# EAGLE design midicontrol_v4 (EAGLE 9.4.0)
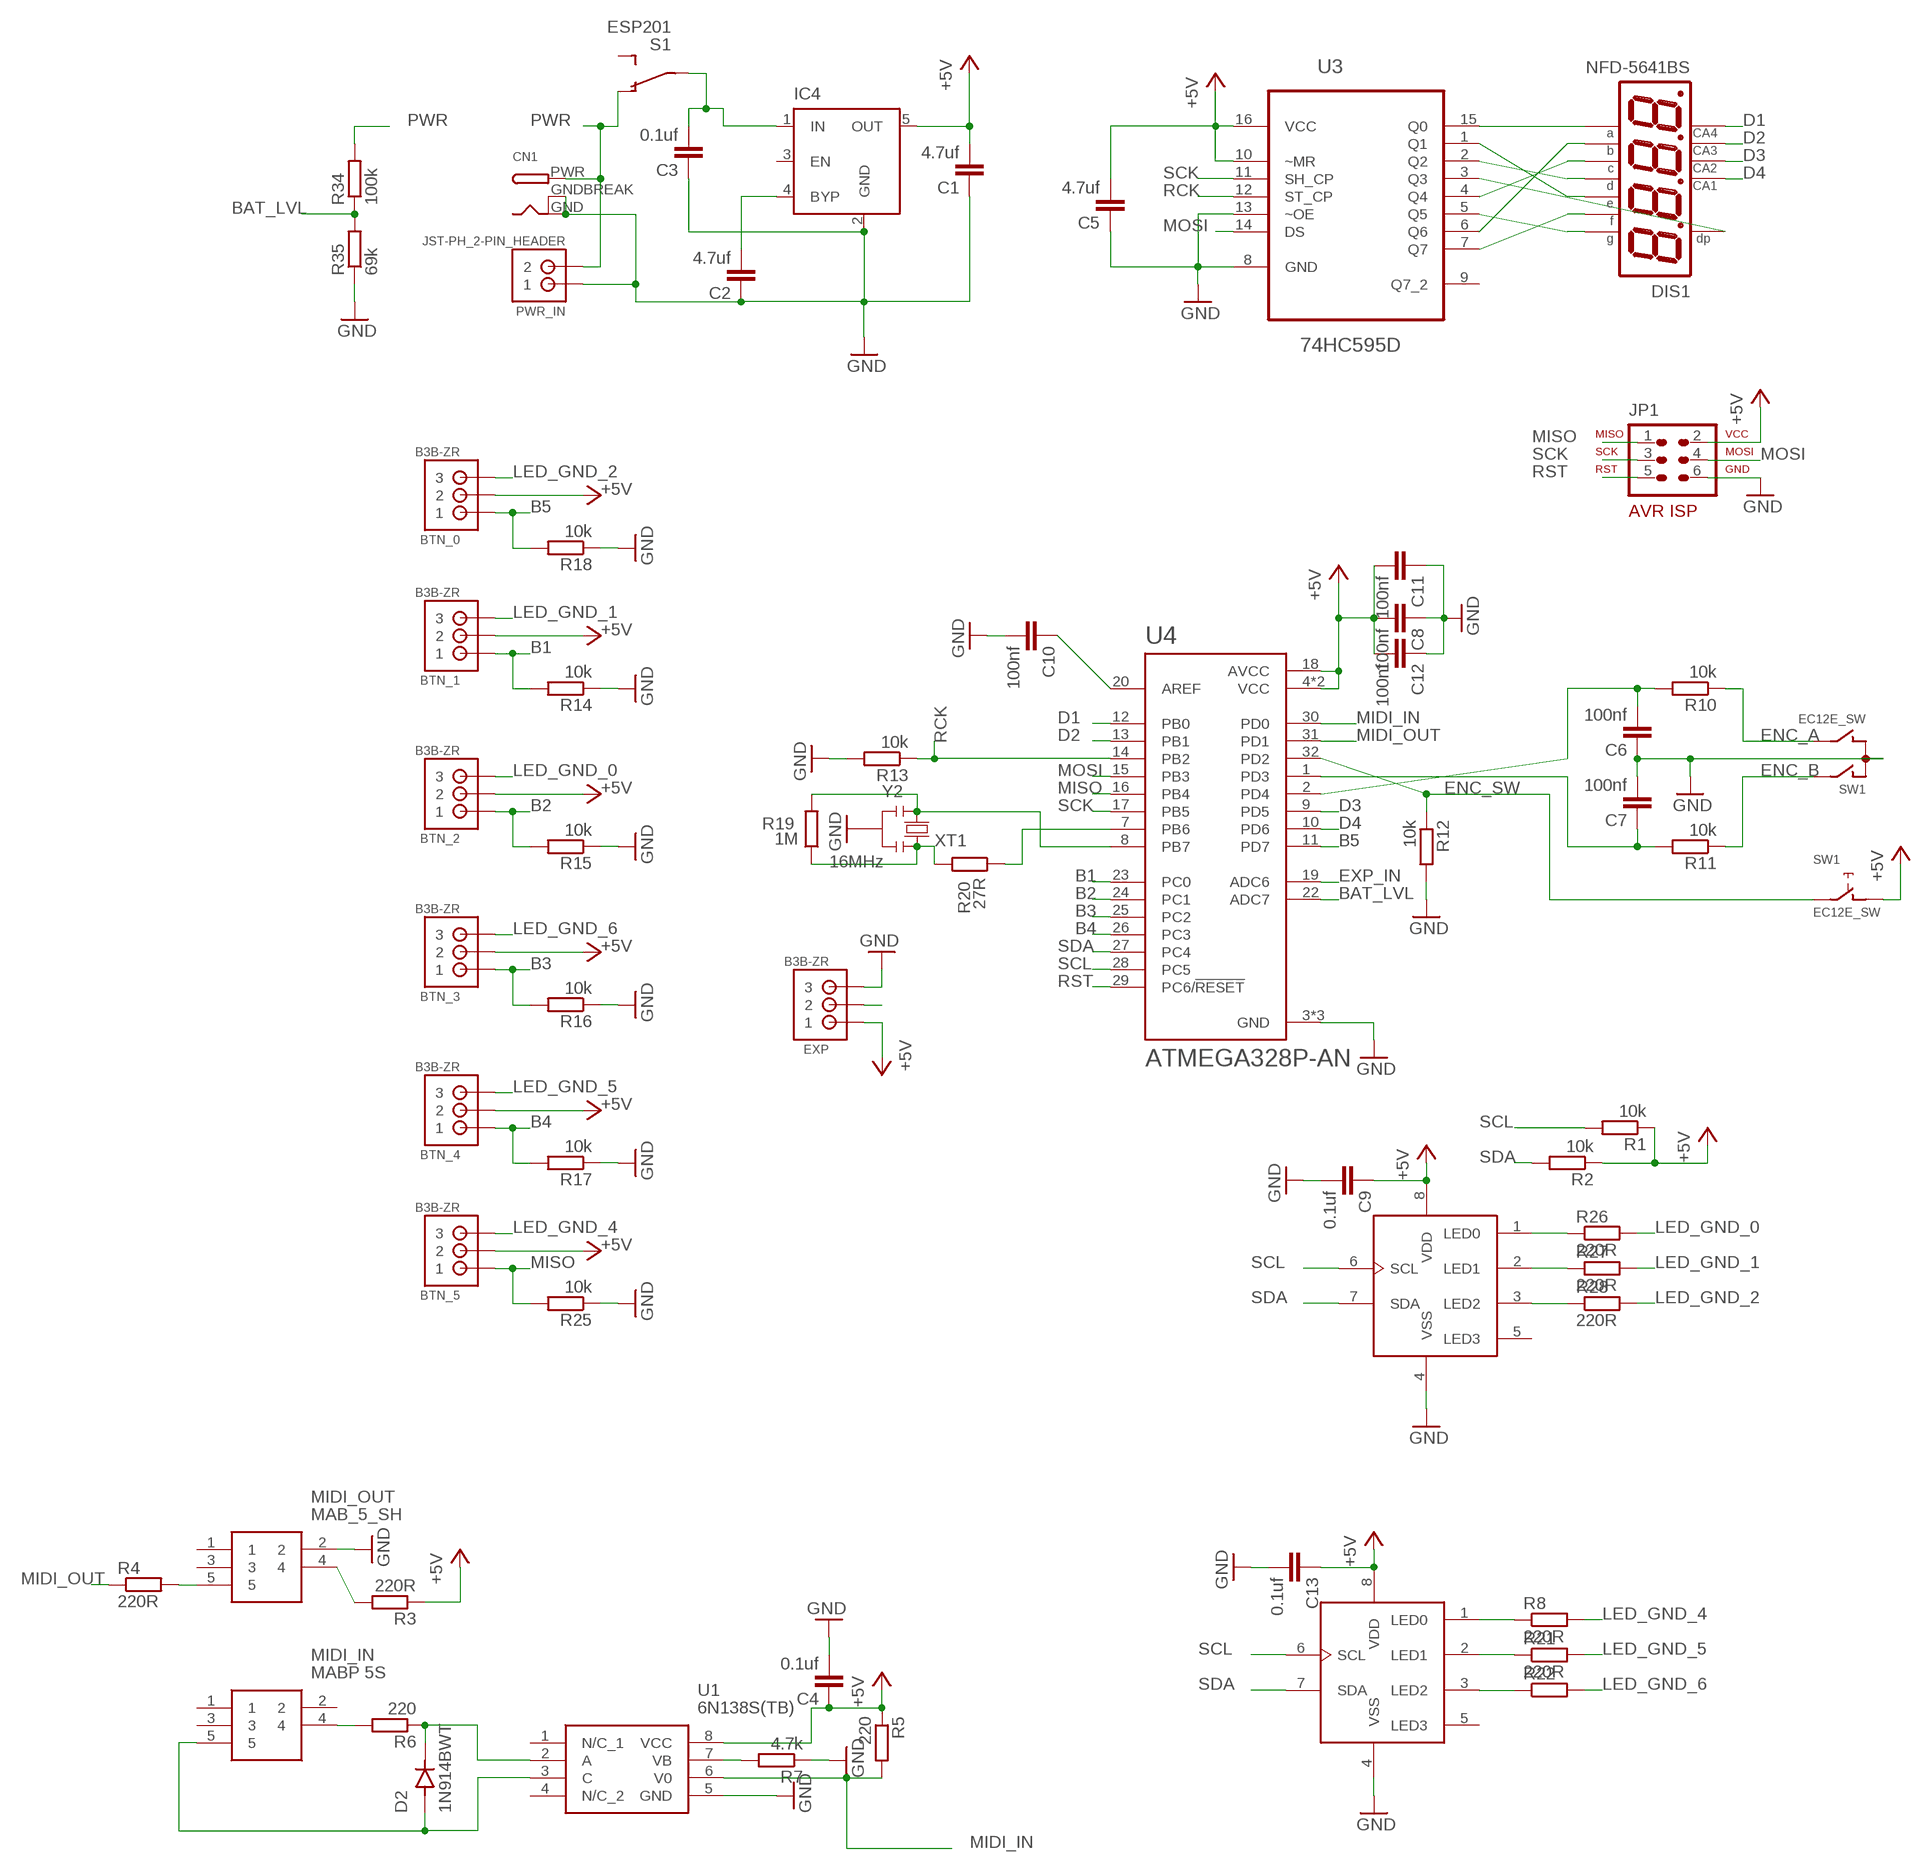
[diagram p0: schematic, sheet 1]

## Parts
BTN_0  B3B-ZR  [B3B-ZR]
BTN_1  B3B-ZR  [B3B-ZR]
BTN_2  B3B-ZR  [B3B-ZR]
BTN_3  B3B-ZR  [B3B-ZR]
BTN_4  B3B-ZR  [B3B-ZR]
BTN_5  B3B-ZR  [B3B-ZR]
C1  4.7uf  C-EUC1206  [C1206]
C2  4.7uf  C-EUC1206  [C1206]
C3  0.1uf  C-EUC1206  [C1206]
C4  0.1uf  C-EUC0603  [C0603]
C5  4.7uf  C-EUC0603  [C0603]
C6  100nf  C-EUC0603  [C0603]
C7  100nf  C-EUC0603  [C0603]
C8  100nf  C-EUC1206  [C1206]
C9  0.1uf  C-EUC0603  [C0603]
C10  100nf  C-EUC0603  [C0603]
C11  100nf  C-EUC0603  [C0603]
C12  100nf  C-EUC0603  [C0603]
C13  0.1uf  C-EUC0603  [C0603]
CN1  DCBARRELPTH  [DCJACK_2MM_PTH]
D2  1N914BWT  [SODFL1608X70N]
DIS1  NFD-5641BS  [NFD-5641]
EXP  B3B-ZR  [B3B-ZR]
IC4  MIC5219XX  [SOT23-5]
JP1  AVR-ISP-6HORZ  [AVR-ISP-6R]
MIDI_IN  MABP 5S  MAB_5_SH  [MAB-5-SH]
MIDI_OUT  MAB_5_SH  [MAB-5-SH]
PCA1  PCA9533  [SOIC8]
PCA9533  PCA9533  [SOIC8]
PWR_IN  JST-PH_2-PIN_HEADER  [JST_B2B-PH_HEADER]
R1  10k  R-EU_R0603  [R0603]
R2  10k  R-EU_R0603  [R0603]
R3  220R  R-EU_R0603  [R0603]
R4  220R  R-EU_R0603  [R0603]
R5  220  R-EU_R0603  [R0603]
R6  220  R-EU_R0603  [R0603]
R7  4.7k  R-EU_R0603  [R0603]
R8  220R  R-EU_R0603  [R0603]
R10  10k  R-EU_R0603  [R0603]
R11  10k  R-EU_R0603  [R0603]
R12  10k  R-EU_R0603  [R0603]
R13  10k  R-EU_R0603  [R0603]
R14  10k  R-EU_R0603  [R0603]
R15  10k  R-EU_R0603  [R0603]
R16  10k  R-EU_R0603  [R0603]
R17  10k  R-EU_R0603  [R0603]
R18  10k  R-EU_R0603  [R0603]
R19  1M  R-EU_R0603  [R0603-ROUND]
R20  27R  R-EU_R0603  [R0603-ROUND]
R21  220R  R-EU_R0603  [R0603]
R22  220R  R-EU_R0603  [R0603]
R25  10k  R-EU_R0603  [R0603]
R26  220R  R-EU_R0603  [R0603]
R27  220R  R-EU_R0603  [R0603]
R28  220R  R-EU_R0603  [R0603]
R34  100k  R-EU_R0603  [R0603]
R35  69k  R-EU_R0603  [R0603]
S1  ESP201  [ESP201]
SW1  EC12E_SW  [ALPS_EC12E_SW]
U1  6N138S(TB)  [SOP254P1030X460-8N]
U3  74HC595D  [SOIC127P600X175-16N]
U4  ATMEGA328P-AN  [QFP80P900X900X120-32N]
Y2  16MHz  RESONATORMU  [RESONATOR]

## Nets
+5V: BTN_0.2 BTN_1.2 BTN_2.2 BTN_3.2 BTN_4.2 BTN_5.2 C1.2 C4.1 C5.2 C8.2 C9.1 C11.2 C12.2 C13.1 EXP.1 IC4.5(OUT) JP1.2 PCA1.8(VDD) PCA9533.8(VDD) R1.1 R2.1 R3.1 R5.1 SW1.D U1.8(VCC) U3.10(~MR) U3.16(VCC) U4.4(VCC) U4.6(VCC) U4.18(AVCC)
B1: BTN_1.1 R14.2 U4.23(PC0)
B2: BTN_2.1 R15.2 U4.24(PC1)
B3: BTN_3.1 R16.2 U4.25(PC2)
B4: BTN_4.1 R17.2 U4.26(PC3)
B5: BTN_0.1 R18.2 U4.11(PD7)
BAT_LVL: R34.1 R35.2 U4.22(ADC7)
D1: DIS1.P$6 U4.12(PB0)
D2: DIS1.P$8 U4.13(PB1)
D3: DIS1.P$9 U4.9(PD5)
D4: DIS1.P$12 U4.10(PD6)
ENC_A: R10.1 SW1.B
ENC_B: R11.1 SW1.A
ENC_SW: R12.1 SW1.E U4.32(PD2)
EXP_IN: EXP.2 U4.19(ADC6)
GND: C1.1 C2.1 C3.1 C4.2 C5.1 C6.1 C7.2 C8.1 C9.2 C10.2 C11.1 C12.1 C13.2 CN1.GND CN1.GNDBREAK EXP.3 IC4.2(GND) JP1.6 MIDI_OUT.2 PCA1.4(VSS) PCA9533.4(VSS) PWR_IN.P1 R7.1 R12.2 R13.2 R14.1 R15.1 R16.1 R17.1 R18.1 R25.1 R35.1 SW1.C U1.5(GND) U3.8(GND) U3.13(~OE) U4.3(GND) U4.5(GND) U4.21(GND) Y2.2
LED_GND_0: BTN_2.3 R26.2
LED_GND_1: BTN_1.3 R27.2
LED_GND_2: BTN_0.3 R28.2
LED_GND_4: BTN_5.3 R8.2
LED_GND_5: BTN_4.3 R21.2
LED_GND_6: BTN_3.3 R22.2
MIDI_IN: R5.2 U1.6(V0) U4.30(PD0)
MIDI_OUT: R4.1 U4.31(PD1)
MISO: BTN_5.1 JP1.1 R25.2 U4.16(PB4)
MOSI: JP1.4 U3.14(DS) U4.15(PB3)
N$1: DIS1.P$11 U3.15(Q0)
N$2: DIS1.P$7 U3.6(Q6)
N$3: DIS1.P$4 U3.4(Q4)
N$4: DIS1.P$2 U3.2(Q2)
N$5: DIS1.P$1 U3.1(Q1)
N$6: DIS1.P$10 U3.7(Q7)
N$7: DIS1.P$5 U3.5(Q5)
N$8: DIS1.P$3 U3.3(Q3)
N$9: MIDI_OUT.4 R3.2
N$10: MIDI_OUT.5 R4.2
N$11: D2.A MIDI_IN.5 U1.3(C)
N$12: D2.C(K) R6.1 U1.2(A)
N$13: MIDI_IN.4 R6.2
N$14: R7.2 U1.7(VB)
N$15: C6.2 R10.2 U4.2(PD4)
N$16: R20.1 U4.7(PB6)
N$17: C7.1 R11.2 U4.1(PD3)
N$20: C2.2 IC4.4(BYP)
N$21: C10.1 U4.20(AREF)
N$22: PCA9533.1(LED0) R26.1
N$23: PCA9533.2(LED1) R27.1
N$24: PCA9533.3(LED2) R28.1
N$26: C3.2 IC4.1(IN) S1.P$1(P)
N$27: PCA1.2(LED1) R21.1
N$28: PCA1.1(LED0) R8.1
N$29: PCA1.3(LED2) R22.1
PWR: CN1.PWR PWR_IN.P2 R34.2 S1.P$3(O)
RCK: R13.1 U3.12(ST_CP) U4.14(PB2)
RST: JP1.5 U4.29(PC6/!RESET)
SCK: JP1.3 U3.11(SH_CP) U4.17(PB5)
SCL: PCA1.6(SCL) PCA9533.6(SCL) R1.2 U4.28(PC5)
SDA: PCA1.7(SDA) PCA9533.7(SDA) R2.2 U4.27(PC4)
XT1: R19.1 R20.2 Y2.3
XTAL2: R19.2 U4.8(PB7) Y2.1
Unconnected: IC4.3(EN) MIDI_IN.1 MIDI_IN.2 MIDI_IN.3 MIDI_OUT.1 MIDI_OUT.3 PCA1.5(LED3) PCA9533.5(LED3) S1.P$2(S) SW1.GND1(G) SW1.GND2(G) U1.1(N/C_1) U1.4(N/C_2) U3.9(Q7_2)

## Library data of the parts
BTN_0 BTN_1-BTN_5 EXP = jst:B3B-ZR: JST-ZH Connector 3 pol, 1.5mm pitch Package: B3B-ZR Source: http://www.jst-mfg.com/product/pdf/eng/eZH.pdf
C1-C13 = rcl:C-EU: CAPACITOR, European symbol; SPICEPREFIX: C
CN1 = adafruit:DCBARREL: 2.0mm DC Barrel Jack DCJACK_2MM_PTH - Through Hole Jack (4UConnector: 05537)
D2 = 1N914BWT:1N914BWT: 1N914B Series 75 V 300 mA Surface Mount Small Signal Diode - SOD-523F; AVAILABILITY: Unavailable; DESCRIPTION: 1N914B Series 75 V 300 mA Surface Mount Small Signal Diode - SOD-523F; MF: ON Semiconductor; MP: 1N914BWT; PACKAGE: SOD-523F ON Semiconductor; PRICE: None
DIS1 = display-misc:NFD-5641BS: Four Digit 0.56" CA Seven-Segment LED Display Futurlec part number: 7FR5641BS Created by RobG
IC4 = v-reg-micrel:MIC5219XX: VOLTAGE REGULATOR; OC_FARNELL: unknown; OC_NEWARK: unknown
JP1 = avr-7:AVR-ISP-6: AVR ISP-6 Serial Programming Header
MIDI_IN MIDI_OUT = MAB_5_SH:MAB_5_SH: HIRSCHMANN - MAB 5 SH - SOCKET, DIN, PCB, 5PIN Source: Datasheet <http://www.farnell.com/datasheets/1599432.pdf>; DESCRIPTION: HIRSCHMANN - MAB 5 SH - SOCKET, DIN, PCB, 5PIN; HEIGHT: mm; MANUFACTURER_NAME: Hirschmann; MANUFACTURER_PART_NUMBER: MAB 5 SH
PCA1 PCA9533 = adam - ics:PCA9533: PCA9533D/01: LED driver and dimmer 4 channel, PWM @ 8 bit resolution 25mA / channel sink external resistors per LED I2C protocol @ 400kHz (fast) digikey: 568-3372-5-ND, 8-SOIC, $1.92
PWR_IN = srg:JST-PH_2-PIN_HEADER: 2-pin JST PH Shrouded Header, top entry P/N B2B-PH-K-S Mating connector PHR-2 Mating cable assembly: Sparkfun PRT-09914 <http://www.sparkfun.com/products/9914>
R1-R8 R10-R18 R21 R22 R25-R28 R34 R35 = rcl:R-EU_: RESISTOR, European symbol; SPICEPREFIX: R
R19 R20 = SmartPrj:R-EU_: RESISTOR, European symbol
S1 = olli:ESP201: Switch ESP201 available at reichelt.de
SW1 = switch-alps:EC12E_SW: ALPS rotary Encoder EC12E series with switch; MPN: EC12E2424407; OC_FARNELL: 1520813; OC_NEWARK: 74M1068
U1 = 6N138S(TB):6N138S(TB): High Speed Optocouplers Low Input, High Gain DC Input Source: Datasheet <https://componentsearchengine.com/Datasheets/1/6N138S(TB).pdf>; DESCRIPTION: High Speed Optocouplers Low Input, High Gain DC Input; HEIGHT: 4.6mm; MANUFACTURER_NAME: Everlight; MANUFACTURER_PART_NUMBER: 6N138S(TB); MOUSER_PART_NUMBER: 638-6N138STB; MOUSER_PRICE-STOCK: https://www.mouser.com/Search/Refine.aspx?Keyword=638-6N138STB
U3 = 74HC595D:74HC595D: 8-bit serial-in parallel-out shift register; AVAILABILITY: Unavailable; DESCRIPTION: Shift Register Single 8-Bit Serial to Serial/Parallel 16-Pin SO; MF: Toshiba Semiconductor; MP: 74HC595D; PACKAGE: SO-16 NXP Semiconductors; PRICE: None
U4 = ATMEGA328P-AN:ATMEGA328P-AN: ATmega Series 20 MHz 32 KB Flash 2 KB SRAM 8-Bit Microcontroller - TQFP-32; AVAILABILITY: Unavailable; DESCRIPTION: MCU 8-bit ATmega AVR RISC 32KB Flash 2.5V/3.3V/5V 32-Pin TQFP Tray; MF: Microchip; MP: ATMEGA328P-AN; PACKAGE: TQFP-32 Microchip; PRICE: None
Y2 = SmartPrj:RESONATOR

## Net classes
0 default: clearance 0.152 mm

## Board
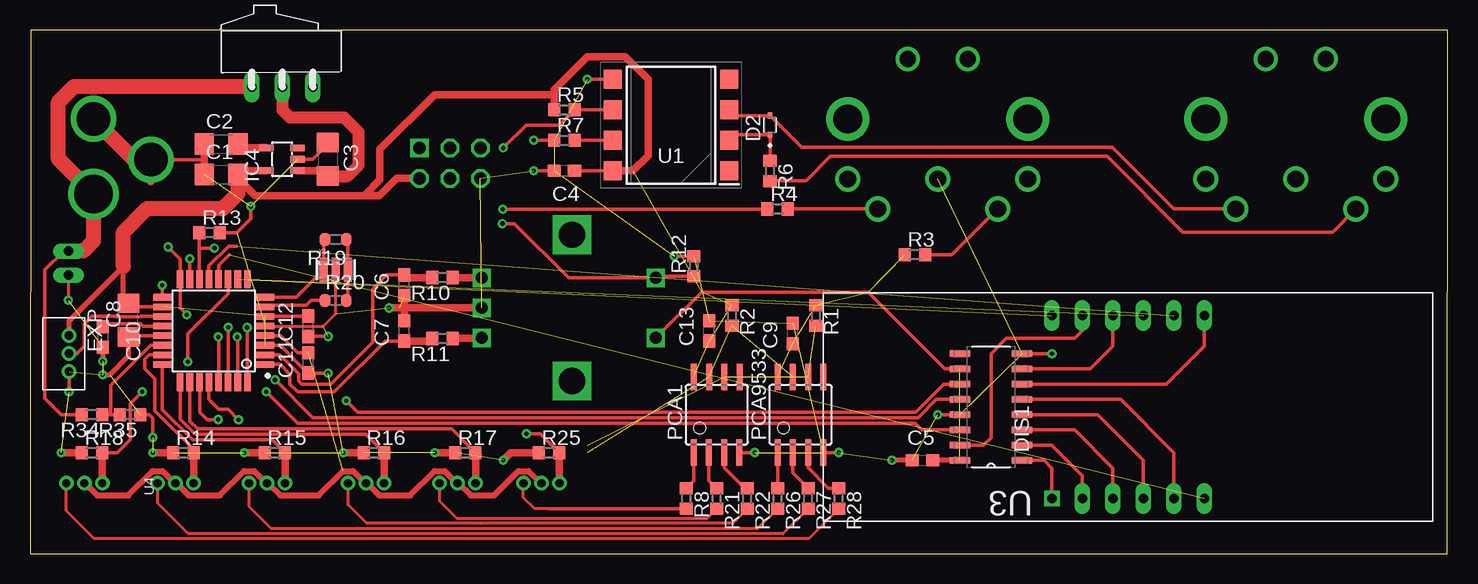
[diagram p1: board, top side]
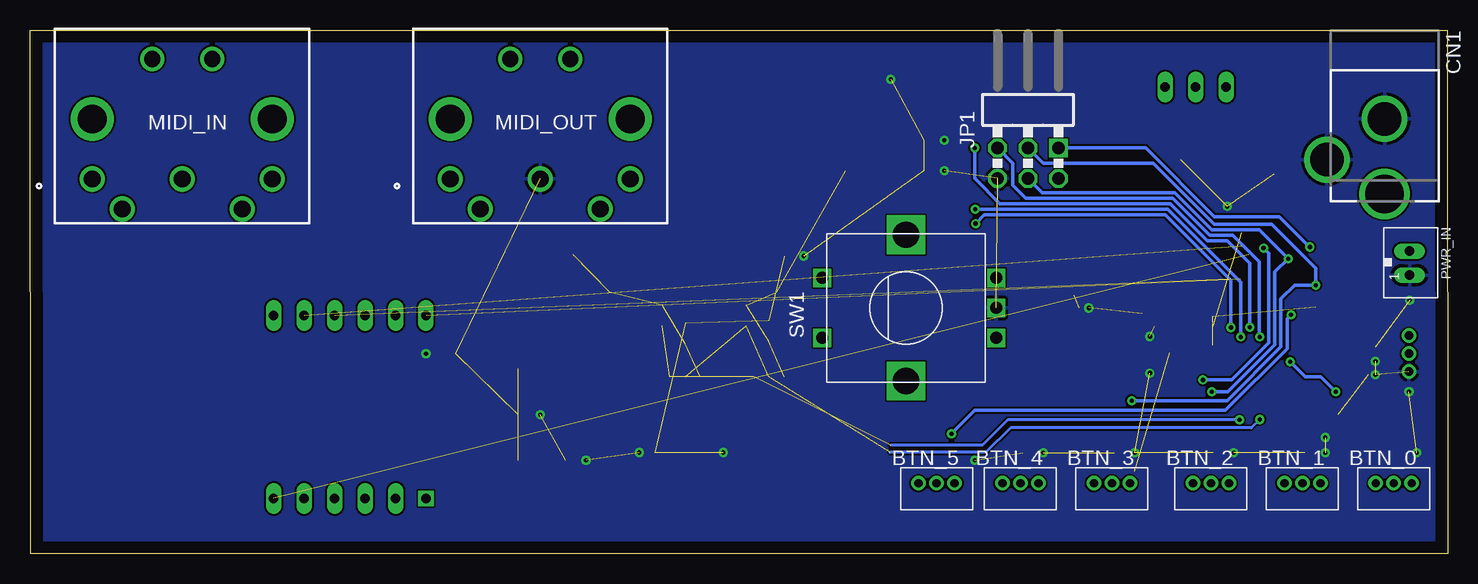
[diagram p2: board, bottom side, seen from below]

Size 118.17 x 43.64 mm. Coordinates in mm from the lower left corner, seen from the top.
Outline: 0,0 118.09,0 118.17,43.64 0.08,43.64 0,0
Copper layers (1*16): Top 0.035mm / dielectric 1.5mm / Bottom 0.035mm
Design rules "default": minimum track width 6mil, minimum drill 0.35mm, track to track 6mil, track to pad 6mil, pad to pad 6mil, via to via 6mil, smd to smd 6mil, copper to edge 40mil, drill to drill 6mil, minimum pad ring 10mil, minimum via ring 8mil, stop-mask expansion 4mil, vias tented up to drill 0mil, thermal gap 10mil

### Footprints (pad centres in the part's own frame; a part is rotated, then mirrored left to right if it is on the bottom)
B3B-ZR = drill 0.7 pad 1.1: 1 -1.5,0; 2 0,0; 3 1.5,0
C1206 = smd 1.6 x 1.8: 1 -1.4,0; 2 1.4,0
C0603 = smd 1.1 x 1: 1 -0.85,0; 2 0.85,0
DCJACK_2MM_PTH = drill 2.8: GND 0,7.35; GNDBREAK 4.8,10.75 | drill 3.2: PWR 0,13.6
SODFL1608X70N = smd 0.53 x 0.4: A 0.8,0; C -0.8,0
NFD-5641 = drill 0.8 square: P$1 -6.35,-7.62 | drill 0.8 long: P$2 -3.81,-7.62; P$3 -1.27,-7.62; P$4 1.27,-7.62; P$5 3.81,-7.62; P$6 6.35,-7.62; P$7 6.35,7.62; P$8 3.81,7.62; P$9 1.27,7.62; P$10 -1.27,7.62; P$11 -3.81,7.62; P$12 -6.35,7.62
SOT23-5 = smd 0.55 x 1.2: 1 -0.95,-1.3; 2 0,-1.3; 3 0.95,-1.3; 4 0.95,1.3; 5 -0.95,1.3
AVR-ISP-6R = drill 1.016 square: 1 -2.54,-1.27 | drill 1.016 octagon: 2 -2.54,1.27; 3 0,-1.27; 4 0,1.27; 5 2.54,-1.27; 6 2.54,1.27
MAB-5-SH = drill 1.4 pad 2.1: 1 7.5,-2.5; 2 0,-2.5; 3 -7.5,-2.5; 4 5,0; 5 -5,0 | drill 1.35 pad 2: 6 -2.5,-12.5; 7 2.5,-12.5 | drill 2.4 pad 3.6: 8 -7.5,-7.5; 9 7.5,-7.5
SOIC8 = smd 0.5 x 2.2: 1 -1.905,-3.154; 2 -0.645,-3.154; 3 0.625,-3.154; 4 1.895,-3.154; 5 1.905,3.154; 6 0.635,3.154; 7 -0.635,3.154; 8 -1.905,3.154
JST_B2B-PH_HEADER = drill 0.8 long: P1 1.075,0.048; P2 -0.925,0.048
R0603 = smd 1 x 1.1: 1 -0.85,0; 2 0.85,0
R0603-ROUND = smd 0.898 x 1.1: 1 -0.889,0; 2 0.889,0
ESP201 = drill 0.8 long: P$1 0,0; P$2 2.54,0; P$3 -2.54,0
ALPS_EC12E_SW = drill 1 square: A -2.5,-7.5; B 2.5,-7.5; C 0,-7.5; D -2.5,7; E 2.5,7 | drill 2.2 square: GND1 -6.1,0; GND2 6.1,0
SOP254P1030X460-8N = smd 1.5 x 1.6: 1 -4.85,3.81; 2 -4.85,1.27; 3 -4.85,-1.27; 4 -4.85,-3.81; 5 4.85,-3.81; 6 4.85,-1.27; 7 4.85,1.27; 8 4.85,3.81
SOIC127P600X175-16N = smd 1.702 x 0.533: 1 -2.591,4.445; 2 -2.591,3.175; 3 -2.591,1.905; 4 -2.591,0.635; 5 -2.591,-0.635; 6 -2.591,-1.905; 7 -2.591,-3.175; 8 -2.591,-4.445; 9 2.591,-4.445; 10 2.591,-3.175; 11 2.591,-1.905; 12 2.591,-0.635; 13 2.591,0.635; 14 2.591,1.905; 15 2.591,3.175; 16 2.591,4.445
QFP80P900X900X120-32N = smd 1.5 x 0.55: 1 -4.3,2.8; 2 -4.3,2; 3 -4.3,1.2; 4 -4.3,0.4; 5 -4.3,-0.4; 6 -4.3,-1.2; 7 -4.3,-2; 8 -4.3,-2.8; 17 4.3,-2.8; 18 4.3,-2; 19 4.3,-1.2; 20 4.3,-0.4; 21 4.3,0.4; 22 4.3,1.2; 23 4.3,2; 24 4.3,2.8 | smd 0.55 x 1.5: 9 -2.8,-4.3; 10 -2,-4.3; 11 -1.2,-4.3; 12 -0.4,-4.3; 13 0.4,-4.3; 14 1.2,-4.3; 15 2,-4.3; 16 2.8,-4.3; 25 2.8,4.3; 26 2,4.3; 27 1.2,4.3; 28 0.4,4.3; 29 -0.4,4.3; 30 -1.2,4.3; 31 -2,4.3; 32 -2.8,4.3
RESONATOR = smd 0.7 x 2: 1 -1,0; 2 0,0; 3 1,0

### Placement (x,y rotation side)
BTN_0  4.52,5.87 0 bottom
BTN_1  12.14,5.87 0 bottom
BTN_2  19.76,5.87 0 bottom
BTN_3  28.02,5.87 0 bottom
BTN_4  35.64,5.87 0 bottom
BTN_5  42.62,5.87 0 bottom
C1  15.93,31.6 0 top
C2  15.93,34.14 0 top
C3  24.82,32.87 270 top
C4  44.53,31.9 180 top
C5  74.37,7.77 0 top
C6  31.19,22.38 90 top
C7  31.19,18.57 90 top
C8  8.2,19.46 90 top
C9  63.58,18.35 90 top
C10  6.05,18.06 270 top
C11  23.19,15.9 90 top
C12  23.19,18.95 90 top
C13  56.59,18.57 90 top
CN1  5.28,43.59 180 bottom
D2  61.67,35.71 90 top
DIS1  91.52,12.22 0 top
EXP  3.25,16.66 270 top
IC4  21.01,32.87 90 top
JP1  35,32.54 180 bottom
MIDI_IN  105.49,28.73 180 bottom
MIDI_OUT  75.64,28.73 180 bottom
PCA1  57.23,11.58 0 top
PCA9533  64.21,11.58 0 top
PWR_IN  3.25,24.28 270 bottom
R1  65.48,19.84 270 top
R2  58.5,19.84 270 top
R3  73.74,24.92 0 top
R4  62.31,28.73 0 top
R5  44.53,36.98 0 top
R6  61.67,31.9 270 top
R7  44.53,34.44 0 top
R8  54.69,4.6 270 top
R10  34.37,23.01 180 top
R11  34.37,17.93 180 top
R12  55.32,23.95 90 top
R13  14.96,26.75 0 top
R14  12.78,8.41 0 top
R15  20.4,8.41 0 top
R16  28.65,8.41 0 top
R17  36.27,8.41 0 top
R18  5.16,8.41 0 top
R19  25.48,26.19 180 top
R20  25.48,21.11 0 top
R21  57.23,4.6 270 top
R22  59.77,4.6 270 top
R25  43.26,8.41 0 top
R26  62.31,4.6 270 top
R27  64.85,4.6 270 top
R28  67.39,4.6 270 top
R34  5.16,11.58 180 top
R35  8.33,11.58 180 top
S1  21.03,38.89 0 top
SW1  45.16,20.47 90 bottom
U1  53.42,35.71 180 top
U3  80.09,12.22 180 top
U4  15.32,18.57 180 top
Y2  25.48,23.65 0 top

### Tracks (layer width: path | path; a pad name or v marks a point on that pad's centre or on a via)
+5V  (12 unrouted)
  Top 0.305: U4.6 19.65,19.8 C12.2 | C11.2 22.3,16.75 20.88,18.17 U4.4 | C8.2 8.47,20.57 U4.18 | C4.1 U1.8 | U3.10 76.23,15.39 69.84,21.78 55.97,21.78 SW1.D
  Top 0.406: U3.16 C5.2 | EXP.1 3.25,19.41 7.77,23.93 7.77,21.29 C8.2
  Top 0.508: BTN_5.2 42.55,5.87 41.54,6.88 40.7,6.88 38.68,4.86 36.72,4.86 35.71,5.87 BTN_4.2 35.57,5.87 34.56,6.88 33.72,6.88 31.7,4.86 29.1,4.86 28.09,5.87 BTN_3.2 27.95,5.87 26.94,6.88 26.1,6.88 24.08,4.86 20.84,4.86 19.83,5.87 BTN_2.2 19.69,5.87 18.68,6.88 17.84,6.88 15.82,4.86 13.22,4.86 12.21,5.87 BTN_1.2 12.07,5.87 11.06,6.88 10.22,6.88 8.2,4.86 5.6,4.86 4.59,5.87 BTN_0.2
  Top 0.61: IC4.5 17.2,31.92 17.2,31.73 C1.2 17.33,31.27 18.77,29.82 27.84,29.82 | JP1.2 30.56,31.27 29.11,29.82 27.84,29.82 | U1.8 50.24,31.9 51.51,33.17 51.51,39.52 49.61,41.43 46.43,41.43 43.68,38.67 43.68,38.25 | 43.68,38.25 R5.1 | 27.84,29.82 29.16,31.14 29.16,33.68 33.73,38.25 43.68,38.25
  Top 1.27: C1.2 17.33,30 16.06,28.73 9.7,28.73 7.77,26.8 7.77,23.93
B1
  Top 0.305: R14.2 13.63,8.69 10.39,11.92 10.39,13.08 10.39,14.56 9.56,15.39 9.56,16.2 9.92,16.57 U4.23
  Top 0.61: 13.85,8.18 R14.2 13.64,8.39 BTN_1.1
B2
  Top 0.305: R15.2 20.18,9.47 13.55,9.47 11.02,12.01 U4.24
  Top 0.61: 21.47,8.18 R15.2 21.26,8.39 BTN_2.1
B3
  Top 0.305: U4.25 12.52,11.18 13.77,9.93 27.98,9.93 R16.2
  Top 0.61: 29.73,8.18 R16.2 29.52,8.39 BTN_3.1
B4
  Top 0.305: U4.26 13.32,11.04 13.97,10.39 35.14,10.39 R17.2
  Top 0.61: 37.35,8.18 R17.2 37.14,8.39 BTN_4.1
B5  (via drill 0.35)
  Top 0.305: v9.35,13.49 8.36,12.5 8.36,9.5 7.26,8.41 R18.2 | U4.11 16.52,21.67 13.16,18.31 v13.16,16
  Top 0.61: 6.23,8.18 R18.2 6.02,8.39 BTN_0.1
  Bottom 0.305: v13.16,16 11.89,14.73 10.59,14.73 v9.35,13.49
BAT_LVL
  Top 0.305: R34.1 6.73,11.58 | 6.73,11.58 R35.2 | U4.22 10.08,17.37 6.73,14.02 6.73,11.58
D1  (1 unrouted)
  Top 0.305: U4.12 15.72,24.02 16.59,24.89
D2  (1 unrouted)
  Top 0.305: 17.17,25.63 16.54,25.63 14.92,24 U4.13
D3  (1 unrouted)
D4  (1 unrouted)
ENC_A
  Top 0.61: SW1.B 35.26,22.97 R10.1
ENC_B
  Top 0.61: SW1.A 37.62,17.93 R11.1
ENC_SW  (via drill 0.35)
  Top 0.305: R12.1 52.29,23.1 SW1.E 44.9,22.97 40.36,27.51 v39.37,27.51 | v18.09,18.85 18.09,14.29 U4.32
  Bottom 0.305: v18.09,18.85 18.09,22.79 23.55,28.24 38.63,28.24 v39.37,27.51
EXP_IN
  Top 0.305: U4.19 9.25,19.77 9.23,19.75 7.18,19.75 7.16,19.77 5.16,19.77 4.52,19.13 4.52,17.3 3.89,16.66 EXP.2
GND  (via drill 0.35)  (31 unrouted)
  Top 0.254: U4.5 24.44,18.97 25.48,20 Y2.2 | PWR_IN.P1 v3.2,21.11
  Top 0.305: U4.3 20.83,17.37 23.15,15.05 C11.1 v24.84,15.05 | IC4.2 23.55,32.87 24.82,34.14 C3.1 | C12.1 v24.84,18.1 | U3.8 v85.17,16.66 | U3.13 v75.64,11.58 | U4.21 8.64,18.17 C8.1 | EXP.3 v3.25,13.49 | R35.1 9.92,11.58 10.24,11.26 v10.24,9.68 | R12.2 v53.7,24.8 | C4.2 v41.99,31.9 | R7.1 v41.99,34.44 | U1.5 v46.43,39.52 | CN1.GNDBREAK 14.23,32.84 14.53,32.54 | PCA9533.4 v67.39,8.43 | PCA1.4 v60.4,8.43 | R13.2 17.22,26.75 18.39,27.91 v18.39,28.93
  Top 0.406: C5.1 v71.83,7.77 | C10.2 v6.05,16.03 | C8.1 8.2,16.48 6.63,14.91 v6.05,14.91
  Top 0.61: C2.1 14.53,32.54 C1.1 | R14.1 v10.24,8.41 | R15.1 v17.86,8.41 | R16.1 v26.11,8.41 | R17.1 v33.73,8.41 | R18.1 v2.62,8.41 | 10.08,31 CN1.GNDBREAK | C6.1 C7.2 | 30.77,20.47 v29.92,20.47 SW1.C | R25.1 40.08,8.41 v39.45,7.77
  Top 1.27: CN1.GND 8.68,32.84 CN1.GNDBREAK
  pour Bottom: -6.91,47.78 -6.91,-9.37 139.14,-9.37 139.14,49.05 -5.64,49.05
LED_GND_0
  Top 0.254: R26.2 60.62,2.06 20.12,2.06 18.26,3.91 BTN_2.3
LED_GND_1
  Top 0.254: R27.2 62.75,1.65 13.21,1.65 10.64,4.22 BTN_1.3
LED_GND_2
  Top 0.254: R28.2 64.88,1.24 5.33,1.24 3.02,3.56 BTN_0.3
LED_GND_4
  Top 0.254: 43.26,3.75 42.05,3.75 41.12,4.68 BTN_5.3
  Top 0.305: R8.2 43.26,3.75 43.24,3.75
LED_GND_5
  Top 0.254: R21.2 56.4,2.92 35.59,2.92 34.14,4.37 BTN_4.3
LED_GND_6
  Top 0.254: R22.2 59.77,3.7 58.58,2.51 37.54,2.51 37.49,2.51 28.07,2.51 26.52,4.07 BTN_3.3
MIDI_IN  (via drill 0.35)
  Top 0.305: U1.6 R5.2 44.11,35.71 41.35,35.71 v39.45,33.81 | U4.30 v16.52,18.87
  Bottom 0.305: v16.52,18.87 16.52,24.21 18.39,26.09 20.06,26.09 23.14,29.16 37.34,29.16 39.45,31.27 v39.45,33.81
MIDI_OUT  (via drill 0.35)
  Top 0.305: v17.27,18.06 17.32,18.01 U4.31 | R4.1 61.43,28.7 v39.4,28.7
  Bottom 0.305: v39.4,28.7 23.34,28.7 17.27,22.63 v17.27,18.06
MISO  (via drill 0.35)
  Top 0.305: v11.51,25.55 12.52,24.54 U4.16 12.52,20.47 v13.08,19.91 | R25.2 42.53,9.98 v41.38,9.98
  Top 0.61: R25.2 44.12,8.39 BTN_5.1
  Bottom 0.305: v11.51,25.55 14.05,28.09 19.48,28.09 25.2,33.81 JP1.1 | v41.38,9.98 41.38,10.01 39.45,11.94 18.56,11.94 13.41,17.08 13.41,19.58 v13.08,19.91
MOSI  (via drill 0.35)
  Top 0.305: U4.15 v13.32,24.59 | U3.14 74.32,10.31 73.79,10.85 22.33,10.85 v19.69,13.49
  Bottom 0.305: JP1.4 33.81,30.07 22.76,30.07 19.68,27 15.73,27 v13.32,24.59 14.43,23.48 14.43,17.4 18.34,13.49 v19.69,13.49
N$1
  Top 0.305: U3.15 79.45,9.04 80.09,9.68 80.09,16.66 81.36,17.93 87.07,17.93 87.71,18.57 DIS1.P$11
N$2
  Top 0.305: DIS1.P$7 97.87,17.3 94.69,14.12 U3.6
N$3
  Top 0.305: U3.4 88.98,11.58 92.79,7.77 DIS1.P$4
N$4
  Top 0.305: U3.2 85.17,9.04 87.71,6.5 DIS1.P$2
N$5
  Top 0.305: U3.1 84.53,7.77 85.17,7.14 DIS1.P$1
N$6
  Top 0.305: DIS1.P$10 90.25,17.3 88.34,15.39 U3.7
N$7
  Top 0.305: U3.5 90.88,12.85 95.33,8.41 DIS1.P$5
N$8
  Top 0.305: U3.3 87.07,10.31 90.25,7.14 DIS1.P$3
N$9
  Top 0.305: MIDI_OUT.4 76.83,24.92 R3.2
N$10
  Top 0.305: MIDI_OUT.5 R4.2
N$11
  Top 0.305: U1.3 58.74,36.51 D2.A 64.3,33.88 90.17,33.88 95.33,28.73 MIDI_IN.5
N$12
  Top 0.305: U1.2 58.74,34.91 D2.C R6.1
N$13
  Top 0.305: R6.2 61.71,31.09 64.67,31.09 66.68,33.1 89.76,33.1 96.06,26.8 108.56,26.8 MIDI_IN.4
N$14
  Top 0.305: R7.2 U1.7
N$15
  Top 0.305: U4.2 20.8,16.57 22.39,14.98 22.39,14.37 22.64,14.12 25.07,14.12 28.55,17.6 28.55,22.05 29.73,23.23 C6.2
  Top 0.61: R10.2 31.41,23.01 C6.2
N$16
  Top 0.305: R20.1 23.44,21.11 23.03,20.69 19.74,20.69 U4.7
N$17
  Top 0.305: U4.1 20.83,15.77 21.67,14.94 21.67,14.12 22.3,13.49 25.37,13.49 29.6,17.72 C7.1
  Top 0.61: R11.2 33.3,17.72 C7.1
N$20
  Top 0.61: IC4.4 17.65,33.82 C2.2
N$21
  Top 0.305: U4.20 9.42,18.97 9.23,19.16 6.3,19.16 C10.1
N$22
  Top 0.305: PCA9533.1 R26.1
N$23
  Top 0.305: PCA9533.2 63.57,6.73 R27.1
N$24
  Top 0.305: PCA9533.3 64.84,7.15 66.54,5.45 R28.1
N$26
  Top 0.61: IC4.1 24.37,31.92 C3.2
  Top 1.016: S1.P$1 21.03,36.98 21.67,36.35 26.16,36.35 27.38,35.13 27.38,32.38 26.47,31.47 C3.2
N$27
  Top 0.305: PCA1.2 56.58,6.09 R21.1
N$28
  Top 0.305: PCA1.1 55.32,6.08 R8.1
N$29
  Top 0.305: PCA1.3 57.85,7.15 59.55,5.45 R22.1
PWR
  Top 0.305: R34.2 2.62,11.58 1.24,12.95 1.24,23.65 2.8,25.21 PWR_IN.P2
  Top 1.27: PWR_IN.P2 4.43,25.21 5.28,26.06 CN1.PWR 2.36,32.91 2.36,37.62 3.68,38.93 18.45,38.93 S1.P$3
RCK  (via drill 0.35)
  Top 0.305: U4.14 14.12,25.41 | 14.12,25.41 14.12,25.46 v15.37,25.46 | 14.12,25.41 R13.1 | v20.42,14.48 23.57,11.33 74.02,11.33 75.54,12.85 U3.12
  Bottom 0.305: v20.42,14.48 18.03,14.48 14.94,17.57 14.94,25.03 v15.37,25.46
RST  (via drill 0.35)
  Top 0.305: v15.7,18.06 15.72,18.04 U4.29
  Bottom 0.305: JP1.5 36.27,32.54 36.27,30.71 35.18,29.62 22.95,29.62 19.87,26.54 17.96,26.54 15.72,24.31 15.72,18.08 v15.7,18.06
SCK  (via drill 0.35)
  Top 0.305: 10.61,21.37 U4.17 v11.02,22.38 | v26.37,12.75 27.33,11.79 73.83,11.79 76.16,14.12 U3.11
  Bottom 0.305: JP1.3 33.73,32.54 24.57,32.54 19.49,27.46 14.68,27.46 11.02,23.79 v11.02,22.38 12.78,22.38 13.92,21.23 13.92,17.22 18.39,12.75 v26.37,12.75
SCL  (via drill 0.35)  (3 unrouted)
  Top 0.305: U4.28 14.92,12.85 15.75,12.01 16.51,12.01 v17.37,11.15
  Bottom 0.254: v17.37,11.15 36.71,11.15 38.81,9.04 46.43,9.04
SDA  (via drill 0.35)  (3 unrouted)
  Top 0.305: v15.69,11.18 14.77,11.18 14.14,11.8 14.14,14.24 U4.27
  Bottom 0.254: v15.69,11.18 15.7,11.18 16.39,10.49 36.45,10.49 38.51,8.43 46.48,8.43
  Bottom 0.305: v15.69,11.18 15.72,11.15
XT1
  Top 0.305: R19.1 26.48,26.08 Y2.3 26.48,21.22 R20.2
XTAL2
  Top 0.305: R19.2 24.48,26.08 Y2.1 22.2,21.37 U4.8